# EAGLE design CPU Board (EAGLE 8.4.3)
CNAME: SO-DIMM CPU Module; CREVISION: V1; DESIGNER: Henrik K. B. Jensen
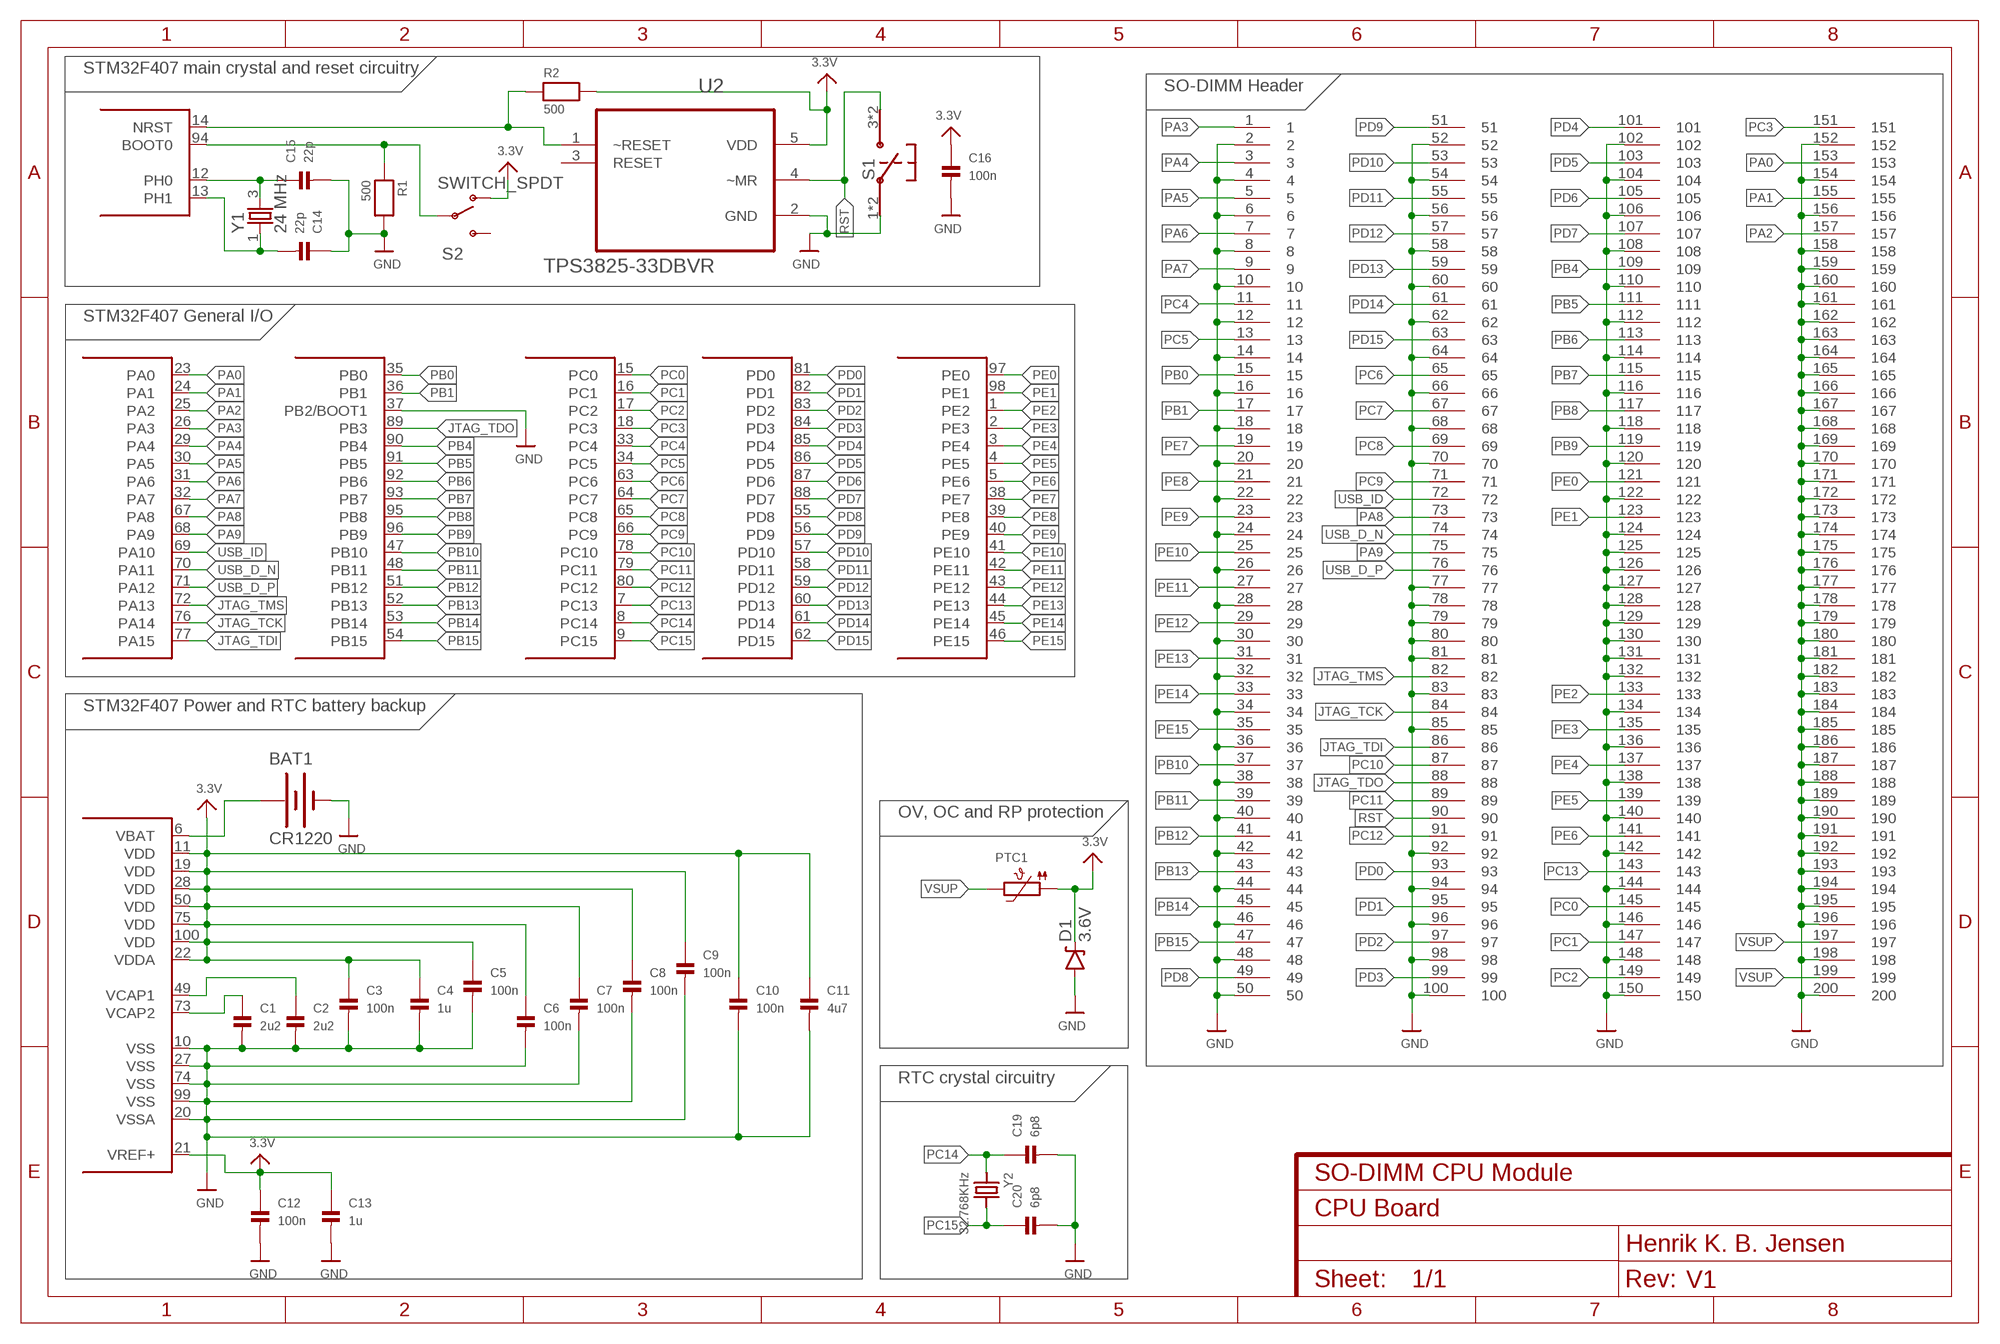
[diagram p0: schematic, sheet 1]

## Parts
BAT1  CR1220  BATTERY12PTH  [BATTCON_12MM_PTH]
C1  2u2  CAP_CERAMIC_0603  [_0603]
C2  2u2  CAP_CERAMIC_0603  [_0603]
C3  100n  CAP_CERAMIC_0603  [_0603]
C4  1u  CAP_CERAMIC_0603  [_0603]
C5  100n  CAP_CERAMIC_0603  [_0603]
C6  100n  CAP_CERAMIC_0603  [_0603]
C7  100n  CAP_CERAMIC_0603  [_0603]
C8  100n  CAP_CERAMIC_0603  [_0603]
C9  100n  CAP_CERAMIC_0603  [_0603]
C10  100n  CAP_CERAMIC_0603  [_0603]
C11  4u7  CAP_CERAMIC_0603  [_0603]
C12  100n  CAP_CERAMIC_0603  [_0603]
C13  1u  CAP_CERAMIC_0603  [_0603]
C14  22p  CAP_CERAMIC_0603  [_0603]
C15  22p  CAP_CERAMIC_0603  [_0603]
C16  100n  CAP_CERAMIC_0603  [_0603]
C19  6p8  CAP_CERAMIC_0603  [_0603]
C20  6p8  CAP_CERAMIC_0603  [_0603]
D1  3.6V  DIODE-ZENER3.3V  [SOD-323]
PTC1  PTC1206  [1206]
R1  500  RESISTOR_0603  [_0603]
R2  500  RESISTOR_0603  [_0603]
S1  PTS645SM43SMTR92  [PTS645]
S2  SWITCH_SPDT  [KPS-1290]
U1  STM32F4-100  [SQFP-S-14X14-100]
U2  TPS3825-33DBVR  [SOT95P280X145-5N]
U$19  SODIMM-2.5V-PCB  [SODIMM-2.5V-PCB]
Y1  24 MHz  CRYSTAL4PIN  [CRYSTAL-4PIN]
Y2  32.768KHz  CRYSTAL32.768  [CRYSTAL_CYL_2X6MM_SMT]

## Nets
3.3V: C3.1 C4.1 C5.1 C6.1 C7.1 C8.1 C9.1 C10.1 C11.1 C12.1 C13.1 C16.1 D1.C PTC1.1 R2.2 S2.O U1.11(VDD) U1.19(VDD) U1.21(VREF+) U1.22(VDDA) U1.28(VDD) U1.50(VDD) U1.75(VDD) U1.100(VDD) U2.5(VDD)
GND: BAT1.GND(-) C1.2 C2.2 C3.2 C4.2 C5.2 C6.2 C7.2 C8.2 C9.2 C10.2 C11.2 C12.2 C13.2 C14.1 C15.2 C16.2 C19.2 C20.2 D1.A R1.2 S1.1 S1.2 U1.10(VSS) U1.20(VSSA) U1.27(VSS) U1.37(PB2/BOOT1) U1.74(VSS) U1.99(VSS) U2.2(GND) U$19.2 U$19.4 U$19.6 U$19.8 U$19.10 U$19.12 U$19.14 U$19.16 U$19.18 U$19.20 U$19.22 U$19.24 U$19.26 U$19.28 U$19.30 U$19.32 U$19.34 U$19.36 U$19.38 U$19.40 U$19.42 U$19.44 U$19.46 U$19.48 U$19.50 U$19.52 U$19.54 U$19.56 U$19.58 U$19.60 U$19.62 U$19.64 U$19.66 U$19.68 U$19.70 U$19.77 U$19.78 U$19.79 U$19.80 U$19.81 U$19.83 U$19.85 U$19.92 U$19.94 U$19.96 U$19.98 U$19.100 U$19.102 U$19.104 U$19.106 U$19.108 U$19.110 U$19.112 U$19.114 U$19.116 U$19.118 U$19.120 U$19.122 U$19.124 U$19.125 U$19.126 U$19.127 U$19.128 U$19.129 U$19.130 U$19.131 U$19.132 U$19.134 U$19.136 U$19.138 U$19.140 U$19.142 U$19.144 U$19.146 U$19.148 U$19.150 U$19.152 U$19.154 U$19.156 U$19.158 U$19.159 U$19.160 U$19.161 U$19.162 U$19.163 U$19.164 U$19.165 U$19.166 U$19.167 U$19.168 U$19.169 U$19.170 U$19.171 U$19.172 U$19.173 U$19.174 U$19.175 U$19.176 U$19.177 U$19.178 U$19.179 U$19.180 U$19.181 U$19.182 U$19.183 U$19.184 U$19.185 U$19.186 U$19.187 U$19.188 U$19.189 U$19.190 U$19.191 U$19.192 U$19.193 U$19.194 U$19.195 U$19.196 U$19.198 U$19.200
JTAG_TCK: U1.76(PA14) U$19.84
JTAG_TDI: U1.77(PA15) U$19.86
JTAG_TDO: U1.89(PB3) U$19.88
JTAG_TMS: U1.72(PA13) U$19.82
N$1: C15.1 U1.12(PH0) Y1.3
N$2: C1.1 U1.73(VCAP2)
N$3: C2.1 U1.49(VCAP1)
N$4: R1.1 S2.P U1.94(BOOT0)
N$6: BAT1.VCC@1(+) U1.6(VBAT)
N$11: C14.2 U1.13(PH1) Y1.1
PA0: U1.23(PA0) U$19.153
PA1: U1.24(PA1) U$19.155
PA2: U1.25(PA2) U$19.157
PA3: U1.26(PA3) U$19.1
PA4: U1.29(PA4) U$19.3
PA5: U1.30(PA5) U$19.5
PA6: U1.31(PA6) U$19.7
PA7: U1.32(PA7) U$19.9
PA8: U1.67(PA8) U$19.73
PA9: U1.68(PA9) U$19.75
PB0: U1.35(PB0) U$19.15
PB1: U1.36(PB1) U$19.17
PB4: U1.90(PB4) U$19.109
PB5: U1.91(PB5) U$19.111
PB6: U1.92(PB6) U$19.113
PB7: U1.93(PB7) U$19.115
PB8: U1.95(PB8) U$19.117
PB9: U1.96(PB9) U$19.119
PB10: U1.47(PB10) U$19.37
PB11: U1.48(PB11) U$19.39
PB12: U1.51(PB12) U$19.41
PB13: U1.52(PB13) U$19.43
PB14: U1.53(PB14) U$19.45
PB15: U1.54(PB15) U$19.47
PC0: U1.15(PC0) U$19.145
PC1: U1.16(PC1) U$19.147
PC2: U1.17(PC2) U$19.149
PC3: U1.18(PC3) U$19.151
PC4: U1.33(PC4) U$19.11
PC5: U1.34(PC5) U$19.13
PC6: U1.63(PC6) U$19.65
PC7: U1.64(PC7) U$19.67
PC8: U1.65(PC8) U$19.69
PC9: U1.66(PC9) U$19.71
PC10: U1.78(PC10) U$19.87
PC11: U1.79(PC11) U$19.89
PC12: U1.80(PC12) U$19.91
PC13: U1.7(PC13) U$19.143
PC14: C19.1 U1.8(PC14) Y2.1
PC15: C20.1 U1.9(PC15) Y2.2
PD0: U1.81(PD0) U$19.93
PD1: U1.82(PD1) U$19.95
PD2: U1.83(PD2) U$19.97
PD3: U1.84(PD3) U$19.99
PD4: U1.85(PD4) U$19.101
PD5: U1.86(PD5) U$19.103
PD6: U1.87(PD6) U$19.105
PD7: U1.88(PD7) U$19.107
PD8: U1.55(PD8) U$19.49
PD9: U1.56(PD9) U$19.51
PD10: U1.57(PD10) U$19.53
PD11: U1.58(PD11) U$19.55
PD12: U1.59(PD12) U$19.57
PD13: U1.60(PD13) U$19.59
PD14: U1.61(PD14) U$19.61
PD15: U1.62(PD15) U$19.63
PE0: U1.97(PE0) U$19.121
PE1: U1.98(PE1) U$19.123
PE2: U1.1(PE2) U$19.133
PE3: U1.2(PE3) U$19.135
PE4: U1.3(PE4) U$19.137
PE5: U1.4(PE5) U$19.139
PE6: U1.5(PE6) U$19.141
PE7: U1.38(PE7) U$19.19
PE8: U1.39(PE8) U$19.21
PE9: U1.40(PE9) U$19.23
PE10: U1.41(PE10) U$19.25
PE11: U1.42(PE11) U$19.27
PE12: U1.43(PE12) U$19.29
PE13: U1.44(PE13) U$19.31
PE14: U1.45(PE14) U$19.33
PE15: U1.46(PE15) U$19.35
RESET: R2.1 U1.14(NRST) U2.1(~RESET)
RST: S1.3 S1.4 U2.4(~MR) U$19.90
USB_D_N: U1.70(PA11) U$19.74
USB_D_P: U1.71(PA12) U$19.76
USB_ID: U1.69(PA10) U$19.72
VSUP: PTC1.2 U$19.197 U$19.199
Unconnected: S2.S U2.3(RESET)

## Notes on the sheet
- STM32F407 main crystal and reset circuitry
- SO-DIMM Header
- STM32F407 General I/O
- STM32F407 Power and RTC battery backup
- OV, OC and RP protection
- RTC crystal circuitry

## Library data of the parts
BAT1 = SparkFun-Electromechanical:BATTERY: Battery Holders Various common sizes : AA, AAA, 18650 (PRT-12895), 20mm coin cell and 12mm coin cell. 20MM_4LEGS, BATT-10373; PROD_ID: BATT-08315
C1-C16 C19 C20 = microbuilder:CAP_CERAMIC: Ceramic Capacitors 0402 - 0402 Surface Mount Capacitors 16pF 50V 5% [Digikey: 445-4899-2-ND] 18pF 50V 5% [Digikey: 490-1281-2-ND] 22pF 50V 5% [Digikey: 490-1283-2-ND] 68pF 50V 5% [Digikey: 490-1289-2-ND] 0.1uF 10V 10% [Digikey: 490-1318-2-ND] 1.0uF 6.3V 10% [Digikey: 490-1320-2-ND] 0603 - 0603 Surface Mount Capacitors 16 pF 50V 5% [Digikey: 445-5051-2-ND] 22 pF 50V [Digikey: PCC220ACVTR-ND] 33 pF 50V 5% [Digikey: 490-1415-1-ND] 56pF 50V 5% [Digikey: 490-1421-1-ND] 220pF 50V 5% [Digikey: 445-1285-1-ND] 680 pF 50V 2200 pF 50V 5% C0G [Digikey: 445-1297-1-ND] 5600 pF 100V 5% X7R [Digikey: 478-3711-1-ND] 0.1 µF 25V 10% [Digikey: PCC2277TR-ND] 0.22 µF 16V 10% X7R [Digikey: 445-1318-1-ND] 1.0 µF 25V 10% [Digikey: 445-5146-2-ND] 0603 - RF Specific 3pF 250V +/-0.1pF RF [Digikey: 712-1347-1-ND] 18 pF 250V 5% [Digikey: 478-3505-1-ND or 712-1322-1-ND] 56 pF 250V 5% C0G RF [Digikey: 490-4867-1-ND] 68 pF 250V RF [Digikey: 490-4868-1-ND] 0805 - 0805 Surface Mount Capacitors 220 pF 250V 2% RF Ceramic Capacitor [Digikey: 712-1398-1-ND] 1000 pF 50V 2% NP0 Ceramic Capacitor [Digikey: 478-3760-1-ND] 0.1 µF 25V 10% Ceramic Capacitor [Digikey: PCC1828TR-ND] 1.0 µF 16V 10% Ceramic Capacitor[Digikey: 490-1691-2-ND] 10.0 µF 10V 10% Ceramic Capacitor[Digikey: 709-1228-1-ND] 10.0 uF 16V 10% Ceramic Capacitor [Digikey: 478-5165-2-ND] 47 uF 6.3V 20% Ceramic Capacitor [Digikey: 587-1779-1-ND or 399-5506-1-ND] 1206 - 1206 Surface Mount Capacitors 47uF 10V 20% Ceramic Capacitor [Digikey: 490-5528-1-ND or 399-5508-1-ND or 445-6010-1-ND] 100uF 6.3V -20%, +80% Y5V Ceramic Capacitor (Digikey: 490-4512-1-ND, Mouser: 81-GRM31CF50J107ZE1L)
D1 = SparkFun-DiscreteSemi:DIODE-ZENER: Zener Diode Production Part - 8199 3.4V Zener Voltage; PROD_ID: DIO-11284; VALUE: 3.3V
PTC1 = microbuilder:PTC: PTC (Resettable Fuse) 1206 Package 250mA PTC (16V Max, Time-to-Trip: 0.08s) - Digikey: F2110CT-ND 1210 Package 100mA PTC (30V Max, Time-to-Trip: 0.6s) - Digikey: MF-USMF010-2CT-ND 1812 Package 750mA PTC (24V Max, Time-to-Trip: 0.2s) - Digikey: MF-MSMF075/24-2CT-ND
R1 R2 = microbuilder:RESISTOR: Resistors 0402 - 0402 Surface Mount Package 22 Ohm 1% 1/16W [Digikey: 311-22.0LRTR-ND] 33 Ohm 5% 1/16W 1.0K 5% 1/16W 1.5K 5% 1/16W 2.0K 1% 1/16W 10.0K 1% 1/16W [Digikey: 311-10.0KLRTR-ND] 10.0K 5% 1/16W [Digikey: RMCF0402JT10K0TR-ND] 12.1K 1% 1/16W [Digikey: 311-22.0LRTR-ND] 100.0K 5% 1/16W 0603 - 0603 Surface Mount Package 0 Ohm 1/10 Watt 1% Resistor 15 Ohm 1/10 Watt 1% Resistor 33 Ohm 1/10 Watt 1% Resistor 49.9 Ohm 1/10 Watt 1% Resistor 100 Ohm 1/10 Watt 1% Resistor 150 Ohm 1/10 Watt 1% Resistor 240 Ohm 1/10 Watt 1% Resistor 390 Ohm 1/10 Watt 1% Resistor 560 Ohm 1/10 Watt 1% Resistor 680 Ohm 1/10 Watt 1% Resistor 750 Ohm 1/10 Watt 1% Resistor 1.0K Ohm 1/10 Watt 1% Resistor 1.5K Ohm 1/10 Watt 1% Resistor 2.0K Ohm 1/10 Watt 1% Resistor 2.2K Ohm 1/10 Watt 1% Resistor 3.3K Ohm 1/10 Watt 1% Resistor 4.7K Ohm 1/10 Watt 1% Resistor 10.0K Ohm 1/10 Watt 1% Resistor 12.0K Ohm 1/10 Watt 1% Resistor 12.1K Ohm 1/10 Watt 1% Resistor 20.0K Ohm 1/10 Watt 1% Resistor 33.0K Ohm 1/10 Watt 1% Resistor 100.0K Ohm 1/10 Watt 1% Resistor 0805 - 0805 Surface Mount Package 0 Ohm 1/8 Watt 1% Resistor 33 Ohm 1/8 Watt 1% Resistor 100 Ohm 1/8 Watt 1% Resistor 150 Ohm 1/8 Watt 1% Resistor 200 Ohm 1/8 Watt 1% Resistor 240 Ohm 1/8 Watt 1% Resistor 330 Ohm 1/8 Watt 1% Resistor 390 Ohm 1/8 Watt 1% Resistor 470 Ohm 1/8 Watt 1% Resistor 1.0K Ohm 1/8 Watt 1% Resistor 1.5K Ohm 1/8 Watt 1% Resistor 2.0K Ohm 1/8 Watt 1% Resistor 4.7K Ohm 1/8 Watt 1% Resistor 5.1K Ohm 1/8 Watt 1% Resistor 5.6K Ohm 1/8 Watt 1% Resistor 10.0K Ohm 1/8 Watt 1% Resistor 22.0K Ohm 1/8 Watt 1% Resistor 33.0K Ohm 1/8 Watt 1% Resistor 100K Ohm 1/8 Watt 1% Resistor 1206 - 1206 Surface Mount Package 2012 - 2010 Surface Mount Package 0.11 Ohm 1/2 Watt 1% Resistor - Digikey: RHM.11UCT-ND
S1 = switches:PTS645SM43SMTR92: Tactile Switch SPST-NO Top Actuated Surface Mount; DIGIKEY: CKN9112CT-ND
S2 = SparkFun-Electromechanical:SWITCH_SPDT: SWCH-10651 Side-actuated SPDT slide switch, as used on the Arduino Pro; PROD_ID: SWCH-10651
U1 = apbteam_stm32:STM32F4-100: STM32F4, 100 pin package According to STM32F40x datasheet, almost compatible with STM32F4xx, STM32F2xx, some pins must be connected differently, see chapter 2.1.
U2 = Texas Instruments_By_element14_Batch_1:TPS3825-33DBVR: PROCESSOR SUPERVISORY CIRCUITS; MPN: TPS3825-33DBVR; OC_FARNELL: 1535758; OC_NEWARK: 77C0425; PACKAGE: SOT-23-5; SUPPLIER: Texas Instruments
U$19 = AAU-Racing:SODIMM-2.5V-PCB
Y1 = BaseApp:CRYSTAL: CRYSTAL SMD-10.5X4.8-2PIN :- http://www.digikey.com/product-detail/en/CX49GFNB12000H0PESZZ/478-4349-1-ND/1532102 SMD-5X3- 4PIN :- 535-11281-1-ND
Y2 = microbuilder:CRYSTAL: Crystals HC49UP - Surface Mount Crystal 4.0MHz 18pF +/-30ppm Surface Mount Crystal [Digikey: 535-9857-1-ND] 12.0 MHz Surface Mount Crystal [Digikey: 535-9869-6-ND] 25.0 MHz Surface Mount Crystal [Digikey: 535-9078-1-ND] 2.5 x 2.0mm - MEMs SMT Crystal 16.0 MHz 10pF 20ppm 2.5 x 2.0mm Crystal [Digikey -40-85°C: 535-10923-1-ND] 3.2 x 2.5mm - MEMs SMT Crystal 12.0 MHz 8pF 15ppm 3.2 x 2.5mm Crystal [Digikey: -10-70°C: 644-1047-1-ND -40-125°C: 644-1128-1-ND] 16.0 MHz 8pF 15ppm 3.2 x 2.5mm Crystal [Digikey: -10-70°C: 644-1049-1-ND -40-125°C: 644-1129-2-ND] 16.0 MHz 10pF 10ppm 3.2 x 2.5mm Crystal [Digikey: 644-1100-1-ND] 27.12 MHz 18pF 30ppm 3.2 x 2.5mm Crystal [Digikey: 887-1424-1-ND] 27.12MHz 10pF 10ppm 3.2 x 2.5mm Crystal [Digikey: 887-1329-1-ND] 4.9 x 1.8mm - MEMs SMT Crystal 32.768 KHz 12.5pF 20ppm 4.9 x 1.8mm Crystal [Digikey: SE2415CT-ND] 8.0 x 3.8mm - Surface Mount Crystal 32.768kHz 12.5pF 20ppm -40°C-85°C [Digikey: 535-9166-2-ND] Cylinder 32.768KHz Cylinder Crystal (2x6mm body) [Ex. Digikey: 300-8341-2-ND]

## Board
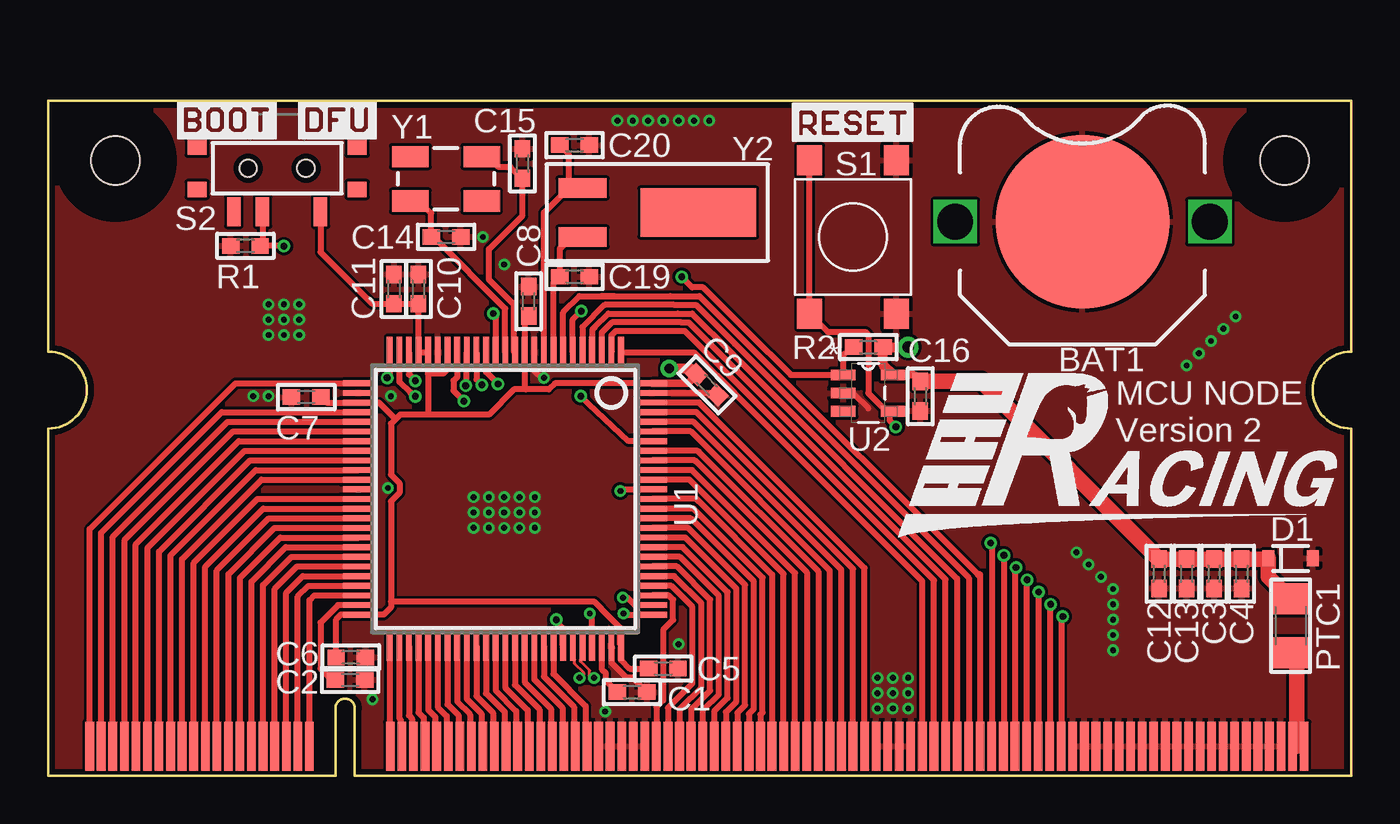
[diagram p1: board, top side]
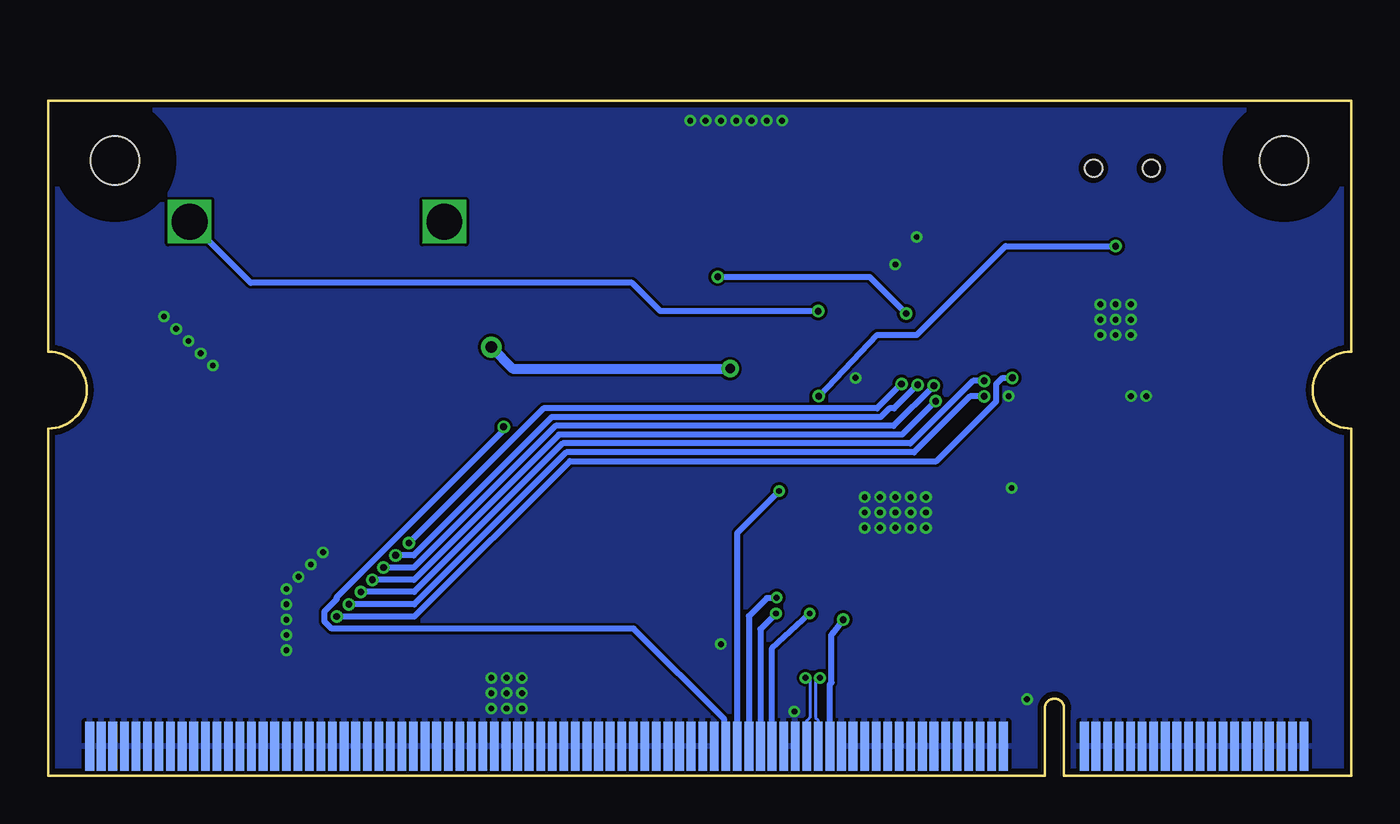
[diagram p2: board, bottom side, seen from below]

Size 67.6 x 35 mm. Coordinates in mm from the lower left corner, seen from the top.
Copper layers (1*16): Top 0.035mm / dielectric 1.5mm / Bottom 0.035mm
Design rules "PCB-POOL Standard": minimum track width 0.15mm, minimum drill 0.3mm, track to track 0.15mm, track to pad 0.15mm, pad to pad 0.15mm, via to via 0.15mm, smd to smd 0.15mm, copper to edge 0.3mm, drill to drill 0.2mm, minimum pad ring 0.2mm, minimum via ring 0.15mm, stop-mask expansion 0.075mm, vias tented up to drill 0mil, thermal gap 0.2mm
Holes 2.5 mm at 3.49,31.91 64.14,31.91
tKeepout: area 0.5,28.9 to 6.5,34.9; area 61.1,28.9 to 67.2,34.9
bKeepout: area 0.5,28.9 to 6.5,34.9; area 61.1,28.9 to 67.2,34.9
tRestrict: area 0.5,28.9 to 6.5,34.9; area 61.1,28.9 to 67.2,34.9
bRestrict: area 0.5,28.9 to 6.5,34.9; area 61.1,28.9 to 67.2,34.9

### Footprints (pad centres in the part's own frame; a part is rotated, then mirrored left to right if it is on the bottom)
BATTCON_12MM_PTH = smd 9 x 9: GND 0,0 | drill 1.854 square: VCC@1 6.604,0; VCC@2 -6.604,0
_0603 = smd 0.9 x 0.8: 1 -0.762,0; 2 0.762,0
SOD-323 = smd 0.63 x 0.83: A 1.15,0; C -1.15,0
1206 = smd 1.6 x 1.8: 1 -1.4,0; 2 1.4,0
PTS645 = smd 1.55 x 1.3: 1 -3.975,2.25; 2 3.975,2.25; 3 3.975,-2.25; 4 -3.975,-2.25
KPS-1290 = smd 0.7 x 1.5: O -2.25,2.25; P 0.75,2.25; S 2.25,2.25 | smd 1 x 0.8: P$1 -4.15,1.1; P$2 -4.15,-1.1; P$3 4.15,-1.1; P$4 4.15,1.1 | hole 0.9: -1.5,0; 1.5,0
SQFP-S-14X14-100 = smd 0.3 x 1.6: 1 -6,-7.6; 2 -5.5,-7.6; 3 -5,-7.6; 4 -4.5,-7.6; 5 -4,-7.6; 6 -3.5,-7.6; 7 -3,-7.6; 8 -2.5,-7.6; 9 -2,-7.6; 10 -1.5,-7.6; 11 -1,-7.6; 12 -0.5,-7.6; 13 0,-7.6; 14 0.5,-7.6; 15 1,-7.6; 16 1.5,-7.6; 17 2,-7.6; 18 2.5,-7.6; 19 3,-7.6; 20 3.5,-7.6; 21 4,-7.6; 22 4.5,-7.6; 23 5,-7.6; 24 5.5,-7.6; 25 6,-7.6; 51 6,7.6; 52 5.5,7.6; 53 5,7.6; 54 4.5,7.6; 55 4,7.6; 56 3.5,7.6; 57 3,7.6; 58 2.5,7.6; 59 2,7.6; 60 1.5,7.6; 61 1,7.6; 62 0.5,7.6; 63 0,7.6; 64 -0.5,7.6; 65 -1,7.6; 66 -1.5,7.6; 67 -2,7.6; 68 -2.5,7.6; 69 -3,7.6; 70 -3.5,7.6; 71 -4,7.6; 72 -4.5,7.6; 73 -5,7.6; 74 -5.5,7.6; 75 -6,7.6 | smd 1.6 x 0.3: 26 7.6,-6; 27 7.6,-5.5; 28 7.6,-5; 29 7.6,-4.5; 30 7.6,-4; 31 7.6,-3.5; 32 7.6,-3; 33 7.6,-2.5; 34 7.6,-2; 35 7.6,-1.5; 36 7.6,-1; 37 7.6,-0.5; 38 7.6,0; 39 7.6,0.5; 40 7.6,1; 41 7.6,1.5; 42 7.6,2; 43 7.6,2.5; 44 7.6,3; 45 7.6,3.5; 46 7.6,4; 47 7.6,4.5; 48 7.6,5; 49 7.6,5.5; 50 7.6,6; 76 -7.6,6; 77 -7.6,5.5; 78 -7.6,5; 79 -7.6,4.5; 80 -7.6,4; 81 -7.6,3.5; 82 -7.6,3; 83 -7.6,2.5; 84 -7.6,2; 85 -7.6,1.5; 86 -7.6,1; 87 -7.6,0.5; 88 -7.6,0; 89 -7.6,-0.5; 90 -7.6,-1; 91 -7.6,-1.5; 92 -7.6,-2; 93 -7.6,-2.5; 94 -7.6,-3; 95 -7.6,-3.5; 96 -7.6,-4; 97 -7.6,-4.5; 98 -7.6,-5; 99 -7.6,-5.5; 100 -7.6,-6
SOT95P280X145-5N = smd 1.27 x 0.559: 1 -1.295,0.94; 2 -1.295,0; 3 -1.295,-0.94; 4 1.295,-0.94; 5 1.295,0.94
SODIMM-2.5V-PCB = smd 0.45 x 2.55: 1 2.15,1.525; 3 2.75,1.525; 5 3.35,1.525; 7 3.95,1.525; 9 4.55,1.525; 11 5.15,1.525; 13 5.75,1.525; 15 6.35,1.525; 17 6.95,1.525; 19 7.55,1.525; 21 8.15,1.525; 23 8.75,1.525; 25 9.35,1.525; 27 9.95,1.525; 29 10.55,1.525; 31 11.15,1.525; 33 11.75,1.525; 35 12.35,1.525; 37 12.95,1.525; 39 13.55,1.525; 41 17.75,1.525; 43 18.35,1.525; 45 18.95,1.525; 47 19.55,1.525; 49 20.15,1.525; 51 20.75,1.525; 53 21.35,1.525; 55 21.95,1.525; 57 22.55,1.525; 59 23.15,1.525; 61 23.75,1.525; 63 24.35,1.525; 65 24.95,1.525; 67 25.55,1.525; 69 26.15,1.525; 71 26.75,1.525; 73 27.35,1.525; 75 27.95,1.525; 77 28.55,1.525; 79 29.15,1.525; 81 29.75,1.525; 83 30.35,1.525; 85 30.95,1.525; 87 31.55,1.525; 89 32.15,1.525; 91 32.75,1.525; 93 33.35,1.525; 95 33.95,1.525; 97 34.55,1.525; 99 35.15,1.525; 101 35.75,1.525; 103 36.35,1.525; 105 36.95,1.525; 107 37.55,1.525; 109 38.15,1.525; 111 38.75,1.525; 113 39.35,1.525; 115 39.95,1.525; 117 40.55,1.525; 119 41.15,1.525; 121 41.75,1.525; 123 42.35,1.525; 125 42.95,1.525; 127 43.55,1.525; 129 44.15,1.525; 131 44.75,1.525; 133 45.35,1.525; 135 45.95,1.525; 137 46.55,1.525; 139 47.15,1.525; 141 47.75,1.525; 143 48.35,1.525; 145 48.95,1.525; 147 49.55,1.525; 149 50.15,1.525; 151 50.75,1.525; 153 51.35,1.525; 155 51.95,1.525; 157 52.55,1.525; 159 53.15,1.525; 161 53.75,1.525; 163 54.35,1.525; 165 54.95,1.525; 167 55.55,1.525; 169 56.15,1.525; 171 56.75,1.525; 173 57.35,1.525; 175 57.95,1.525; 177 58.55,1.525; 179 59.15,1.525; 181 59.75,1.525; 183 60.35,1.525; 185 60.95,1.525; 187 61.55,1.525; 189 62.15,1.525; 191 62.75,1.525; 193 63.35,1.525; 195 63.95,1.525; 197 64.55,1.525; 199 65.15,1.525 | smd 0.45 x 2.55 bottom: 2 2.45,1.525; 4 3.05,1.525; 6 3.65,1.525; 8 4.25,1.525; 10 4.85,1.525; 12 5.45,1.525; 14 6.05,1.525; 16 6.65,1.525; 18 7.25,1.525; 20 7.85,1.525; 22 8.45,1.525; 24 9.05,1.525; 26 9.65,1.525; 28 10.25,1.525; 30 10.85,1.525; 32 11.45,1.525; 34 12.05,1.525; 36 12.65,1.525; 38 13.25,1.525; 40 13.85,1.525; 42 18.05,1.525; 44 18.65,1.525; 46 19.25,1.525; 48 19.85,1.525; 50 20.45,1.525; 52 21.05,1.525; 54 21.65,1.525; 56 22.25,1.525; 58 22.85,1.525; 60 23.45,1.525; 62 24.05,1.525; 64 24.65,1.525; 66 25.25,1.525; 68 25.85,1.525; 70 26.45,1.525; 72 27.05,1.525; 74 27.65,1.525; 76 28.25,1.525; 78 28.85,1.525; 80 29.45,1.525; 82 30.05,1.525; 84 30.65,1.525; 86 31.25,1.525; 88 31.85,1.525; 90 32.45,1.525; 92 33.05,1.525; 94 33.65,1.525; 96 34.25,1.525; 98 34.85,1.525; 100 35.45,1.525; 102 36.05,1.525; 104 36.65,1.525; 106 37.25,1.525; 108 37.85,1.525; 110 38.45,1.525; 112 39.05,1.525; 114 39.65,1.525; 116 40.25,1.525; 118 40.85,1.525; 120 41.45,1.525; 122 42.05,1.525; 124 42.65,1.525; 126 43.25,1.525; 128 43.85,1.525; 130 44.45,1.525; 132 45.05,1.525; 134 45.65,1.525; 136 46.25,1.525; 138 46.85,1.525; 140 47.45,1.525; 142 48.05,1.525; 144 48.65,1.525; 146 49.25,1.525; 148 49.85,1.525; 150 50.45,1.525; 152 51.05,1.525; 154 51.65,1.525; 156 52.25,1.525; 158 52.85,1.525; 160 53.45,1.525; 162 54.05,1.525; 164 54.65,1.525; 166 55.25,1.525; 168 55.85,1.525; 170 56.45,1.525; 172 57.05,1.525; 174 57.65,1.525; 176 58.25,1.525; 178 58.85,1.525; 180 59.45,1.525; 182 60.05,1.525; 184 60.65,1.525; 186 61.25,1.525; 188 61.85,1.525; 190 62.45,1.525; 192 63.05,1.525; 194 63.65,1.525; 196 64.25,1.525; 198 64.85,1.525; 200 65.45,1.525
CRYSTAL-4PIN = smd 1.9 x 1.1: 1 -1.85,-1.15; 2 1.85,-1.15; 3 1.85,1.15; 4 -1.85,1.15
CRYSTAL_CYL_2X6MM_SMT = smd 2.5 x 1: 1 2.125,1.27; 2 2.125,-1.27 | smd 6 x 2.5: CYLINDER -3.875,0

### Placement (x,y rotation side)
BAT1  53.66,28.73 0 top
C1  30.29,4.34 0 top
C2  15.66,4.97 0 top
C3  60.48,10.48 270 top
C4  61.91,10.48 270 top
C5  31.91,5.56 0 top
C6  15.7,6.14 0 top
C7  13.39,19.64 180 top
C8  24.92,24.61 90 top
C9  34.18,20.27 315 top
C10  19.21,25.24 90 top
C11  17.94,25.24 90 top
C12  57.63,10.48 270 top
C13  59.05,10.48 270 top
C14  20.64,27.94 180 top
C15  24.61,31.75 90 top
C16  45.24,19.68 270 top
C19  27.3,25.88 0 top
C20  27.3,32.7 0 top
D1  64.45,11.27 0 top
PTC1  64.45,7.78 270 top
R1  10.24,27.48 180 top
R2  42.55,22.23 0 top
S1  41.75,27.94 270 top
S2  11.87,31.5 180 top
U1  23.71,14.35 180 top
U2  42.55,19.84 0 top
U$19  0,0 0 top
Y1  20.64,30.96 0 top
Y2  29.84,29.21 180 top

### Tracks (layer width: path | path; a pad name or v marks a point on that pad's centre or on a via)
3.3V  (via drill 0.5, 0.6)
  Top 0.305: C6.1 14.94,8.11 15.18,8.35 U1.50 17.4,8.35 17.78,8.73 17.78,9.05 | C7.1 14.43,19.35 U1.28 17.16,19.35 18.02,18.49 | C5.1 30.16,5.56 29.71,6.01 U1.75 29.67,6.8 29.67,7.68 28.7,8.64 28.7,8.66 28.35,9.02 17.81,9.02 17.78,9.05 | C8.1 24.71,23.63 U1.11 24.71,20.09 24.77,20.04 | S2.O 14.12,27.15 16.8,24.48 C11.1 C10.1 U1.22 U1.21 19.71,20.8 | 18.02,18.49 17.78,18.26 17.78,15.62 18.22,15.17 18.22,14.67 17.78,14.23 17.78,9.05 | 19.68,18.73 22.86,18.73 24.16,20.04 24.77,20.04 | 19.68,18.73 18.26,18.73 18.02,18.49 | 19.71,20.8 19.71,18.76 19.68,18.73 | 19.71,20.8 19.77,20.85 20.49,20.85 20.71,21.08 U1.19 | 24.77,20.04 25.97,20.04 26.29,20.35 U1.100
  Top 0.381: C9.1 33.18,20.35 U1.100
  Top 0.406: U2.5 44.91,20.78 C16.1
  Top 0.508: U2.5 43.31,21.32 R2.2 v44.61,22.23 | v32.23,21.11 33.34,21.11 C9.1
  Top 0.813: PTC1.1 63.3,10.33 D1.C 63.27,11.24 C4.1 C3.1 C13.1 C12.1 48.42,20.45 C16.1
  Bottom 0.508: v44.61,22.23 43.5,21.11 v32.23,21.11
GND  (via drill 0.3)
  Top 0.305: C1.2 30.29,5.1 29.97,5.1 29.21,5.86 U1.74 | U1.99 34.6,19.85 C9.2 | U2.2 41.74,19.84 42.54,19.05 | U1.10 25.21,20.98 25.56,20.64 v25.72,20.64
  other vias: 11.43,19.68 10.64,19.68 23.65,26.51 32.7,6.83 28.89,3.33 22.54,27.94 17.78,19.68 43.02,3.49 43.81,3.49 44.61,3.49 43.02,4.29 43.81,4.29 44.61,4.29 44.61,5.08 43.81,5.08 43.02,5.08 16.83,3.97 17.62,14.92 23.65,14.45 13.02,23.65 12.22,23.65 11.43,23.65 11.43,24.45 12.22,24.45 13.02,24.45 13.02,22.86 12.22,22.86 11.43,22.86 29.53,33.97 30.32,33.97 31.11,33.97 31.91,33.97 32.7,33.97 33.5,33.97 34.29,33.97 59.05,21.27 59.69,21.91 60.33,22.54 60.96,23.18 61.59,23.81 53.34,11.59 53.98,10.95 54.61,10.32 55.24,9.68 55.24,8.89 55.24,8.1 55.24,7.3 55.24,6.51 22.86,14.45 22.07,14.45 23.65,13.65 23.65,12.86 24.45,14.45 25.24,14.45 22.07,12.86 22.07,13.65 22.86,13.65 22.86,12.86 24.45,12.86 24.45,13.65 25.24,13.65 25.24,12.86
  pour Top: 0,0 67.63,0 67.63,34.92 0,34.92
  pour Bottom: 0,0 67.63,0 67.63,34.92 0,34.92
JTAG_TCK  (via drill 0.3)
  Top 0.305: v29.84,8.41 29.94,8.35 U1.76
  Bottom 0.305: v29.84,8.41 30.65,7.61 U$19.84
JTAG_TDI  (via drill 0.3)
  Top 0.305: v29.82,9.24 30.05,9.24 30.43,8.85 U1.77
  Bottom 0.305: v29.82,9.24 29.84,9.21 30.32,9.21 31.25,8.28 U$19.86
JTAG_TDO  (via drill 0.3)
  Top 0.305: v29.69,14.76 29.78,14.85 U1.89
  Bottom 0.305: U$19.88 31.85,12.6 v29.69,14.76
JTAG_TMS  (via drill 0.3)
  Top 0.305: U1.72 28.21,8.41 v28.1,8.41
  Bottom 0.305: U$19.82 30.05,6.62 v28.1,8.41
N$1
  Top 0.305: U1.12 24.17,22 24.17,24.42 22.86,25.73 22.86,27.3 24.61,29.05 C15.1 24.57,30.99 23.97,31.59 23.34,31.59 22.82,32.11 Y1.3
N$2
  Top 0.305: U1.73 28.71,5.53 28.92,5.33 28.92,4.95 C1.1
N$3
  Top 0.305: C2.1 14.72,4.97 14.13,5.56 14.13,7.95 15.04,8.85 U1.49
N$4  (via drill 0.35)
  Top 0.305: S2.P 11.12,27.61 R1.1 12.21,27.48 v12.22,27.46 | U1.94 30.11,17.35 v27.62,19.68
  Bottom 0.305: v27.62,19.68 24.61,22.86 22.54,22.86 17.94,27.46 v12.22,27.46
N$6  (via drill 0.35)
  Top 0.305: U1.6 27.21,23.65 v27.66,24.09
  Bottom 0.305: v27.66,24.09 35.84,24.09 37.31,25.56 57.09,25.56 BAT1.VCC@1
N$11
  Top 0.305: U1.13 23.71,24.23 20,27.94 C14.2 19.88,29.18 19.37,29.69 18.91,29.69 Y1.1
PA0  (via drill 0.35)
  Top 0.305: U1.23 18.71,20.82 v19.05,20.48 | v51.38,9.53 51.38,1.55 U$19.153
  Bottom 0.305: v19.05,20.48 19.63,20.48 22.88,17.23 40.91,17.23 48.61,9.53 v51.37,9.53 v51.38,9.53
PA1  (via drill 0.35)
  Top 0.305: v19.05,19.68 18.88,19.85 18.79,19.85 18.21,20.43 U1.24 | 52.01,1.58 U$19.155 51.95,8.84 v52.01,8.89
  Bottom 0.305: v19.05,19.68 19.79,19.68 22.69,16.78 40.72,16.78 48.61,8.89 v52.01,8.89
PA2  (via drill 0.35)
  Top 0.305: U1.25 17.71,20.77 v17.59,20.64 | v52.63,8.26 52.55,8.17 U$19.157
  Bottom 0.305: v52.62,8.26 v52.63,8.26 v52.62,8.26 | v17.59,20.64 18.1,20.64 18.41,20.32 18.41,19.81 18.42,19.8 18.42,19.42 21.52,16.32 40.54,16.32 48.59,8.26 v52.62,8.26
PA3
  Top 0.305: U$19.1 2.15,12.79 9.72,20.35 U1.26
PA4
  Top 0.305: U$19.3 2.75,12.59 9.01,18.85 U1.29
PA5
  Top 0.305: U$19.5 3.35,12.4 9.3,18.35 U1.30
PA6
  Top 0.305: U$19.7 3.95,12.21 9.6,17.85 U1.31
PA7
  Top 0.305: U$19.9 4.55,12.01 9.89,17.35 U1.32
PA8
  Top 0.305: U1.67 25.71,5.14 27.28,3.57 27.28,1.6 U$19.73
PA9
  Top 0.305: U1.68 26.21,5.28 27.88,3.62 27.88,1.6 U$19.75
PB0
  Top 0.305: U$19.15 6.35,11.43 10.77,15.85 U1.35
PB1
  Top 0.305: U$19.17 6.95,11.24 11.07,15.35 U1.36
PB4
  Top 0.305: U$19.109 38.15,10.47 33.27,15.35 U1.90
PB5
  Top 0.305: U$19.111 38.75,10.51 33.41,15.85 U1.91
PB6
  Top 0.305: U$19.113 39.35,10.55 33.6,16.3 | 33.6,16.31 33.6,16.3 | 33.6,16.3 33.55,16.35 U1.92
PB7
  Top 0.305: U$19.115 39.95,10.6 33.77,16.78 | 33.74,16.81 33.77,16.78 | 33.77,16.78 33.7,16.85 U1.93
PB8
  Top 0.305: U$19.117 40.55,10.64 33.34,17.85 U1.95
PB9
  Top 0.305: U$19.119 41.15,10.69 33.48,18.35 U1.96
PB10
  Top 0.305: U$19.37 12.95,9.3 13.51,9.85 U1.47
PB11
  Top 0.305: U$19.39 13.55,9.11 13.8,9.35 U1.48
PB12
  Top 0.305: U1.51 17.71,1.56 U$19.41
PB13
  Top 0.305: U1.52 18.21,2.99 18.28,2.92 18.28,1.6 U$19.43
PB14
  Top 0.305: U1.53 18.71,3.13 18.88,2.97 18.88,1.6 U$19.45
PB15
  Top 0.305: U1.54 19.21,3.28 19.48,3.01 19.48,1.6 U$19.47
PC0  (via drill 0.35)
  Top 0.305: U1.15 22.71,20.94 v23.34,20.32 | v48.9,12.06 48.95,12.01 U$19.145
  Bottom 0.305: v23.34,20.32 24.61,19.05 41.91,19.05 v48.9,12.06
PC1  (via drill 0.35)
  Top 0.305: U1.16 22.21,20.56 v22.5,20.27 | v49.58,11.43 49.58,1.55 U$19.147
  Bottom 0.305: v22.5,20.27 23.72,19.05 23.96,19.05 24.42,18.59 41.48,18.59 48.64,11.43 v49.58,11.43
PC2  (via drill 0.35)
  Top 0.305: U1.17 21.71,20.28 v21.66,20.23 | v50.2,10.79 50.15,10.74 U$19.149
  Bottom 0.305: v50.2,10.79 48.63,10.79 41.29,18.14 23.74,18.14 v21.66,20.23
PC3  (via drill 0.35)
  Top 0.305: v21.57,19.43 21.03,19.97 21.03,20.49 21.21,20.67 U1.18 | v50.78,10.16 50.75,10.13 U$19.151
  Bottom 0.305: v50.78,10.16 48.63,10.16 41.1,17.69 23.31,17.69 v21.57,19.43
PC4
  Top 0.305: U$19.11 5.15,11.82 10.19,16.85 U1.33
PC5
  Top 0.305: U$19.13 5.75,11.62 10.48,16.35 U1.34
PC6
  Top 0.305: U1.63 23.71,4.57 24.88,3.4 24.88,1.6 U$19.65
PC7
  Top 0.305: U1.64 24.21,4.71 25.48,3.44 25.48,1.6 U$19.67
PC8
  Top 0.305: U1.65 24.71,4.85 26.08,3.49 26.08,1.6 U$19.69
PC9
  Top 0.305: U1.66 25.21,5 26.68,3.53 26.68,1.6 U$19.71
PC10
  Top 0.305: U$19.87 31.55,3.56 31.9,3.91 31.9,7.56 32.41,8.08 32.41,9.13 32.19,9.35 U1.78
PC11
  Top 0.305: U$19.89 32.15,3.52 33.42,4.79 33.42,8.76 32.33,9.85 U1.79
PC12
  Top 0.305: U$19.91 32.75,3.47 33.88,4.6 33.88,8.95 32.48,10.35 U1.80
PC13
  Top 0.305: 32.28,24.88 | 48.28,1.6 U$19.143 48.35,10.44 48.22,10.44 | 32.28,24.88 33.78,24.88 36.08,22.58 48.22,10.44 | 48.22,10.44 48.28,10.38 | 29.37,24.88 32.28,24.88 | 29.37,24.88 28.68,24.88 | 28.68,24.88 29.37,24.88 | 28.68,24.88 27.55,24.88 26.71,24.04 U1.7
PC14
  Top 0.305: U1.8 26.21,25.55 C19.1 26.54,27.34 27.15,27.94 Y2.1
PC15
  Top 0.305: U1.9 25.71,28.73 25.71,28.77 25.71,29.2 26.99,30.48 | 26.99,30.48 Y2.2 | C20.1 26.99,32.26 26.99,30.48
PD0
  Top 0.305: U$19.93 33.35,3.43 34.33,4.41 34.33,9.14 32.62,10.85 U1.81
PD1
  Top 0.305: U$19.95 33.95,3.38 34.79,4.22 34.79,9.33 32.76,11.35 U1.82
PD2
  Top 0.305: U$19.97 34.55,3.34 35.24,4.03 35.24,9.52 32.91,11.85 U1.83
PD3
  Top 0.305: U$19.99 35.15,3.3 35.7,3.85 35.7,9.71 33.05,12.35 U1.84
PD4
  Top 0.305: U$19.101 35.75,3.26 36.15,3.66 36.15,9.89 33.19,12.85 U1.85
PD5
  Top 0.305: U$19.103 36.35,3.21 36.61,3.47 36.61,10.08 33.34,13.35 U1.86
PD6
  Top 0.305: U$19.105 36.95,3.17 37.06,3.28 37.06,10.27 33.48,13.85 U1.87
PD7
  Top 0.305: U$19.107 37.55,10.43 33.75,14.22 | 33.67,14.31 33.75,14.22 | 33.75,14.22 33.62,14.35 U1.88
PD8
  Top 0.305: U1.55 19.71,3.42 20.08,3.06 20.08,1.6 U$19.49
PD9
  Top 0.305: U1.56 20.21,3.56 20.68,3.1 20.68,1.6 U$19.51
PD10
  Top 0.305: U1.57 20.71,3.71 21.28,3.14 21.28,1.6 U$19.53
PD11
  Top 0.305: U1.58 21.21,3.85 21.88,3.18 21.88,1.6 U$19.55
PD12
  Top 0.305: U1.59 21.71,3.99 22.48,3.23 22.48,1.6 U$19.57
PD13
  Top 0.305: U1.60 22.21,4.14 23.08,3.27 23.08,1.6 U$19.59
PD14
  Top 0.305: U1.61 22.71,4.28 23.68,3.31 23.68,1.6 U$19.61
PD15
  Top 0.305: U1.62 23.21,4.42 24.28,3.36 24.28,1.6 U$19.63
PE0
  Top 0.305: U$19.121 41.75,10.73 33.62,18.85 U1.97
PE1
  Top 0.305: U$19.123 42.35,10.77 33.77,19.35 U1.98
PE2
  Top 0.305: 35.42,20.02 34.81,20.64 33.49,21.95 U1.1 | 35.42,20.02 | 35.62,19.82 35.42,20.02 | 35.62,19.82 | 33.68,21.76 34.34,21.11 45.35,10.1 U$19.133 | 33.68,21.76 | 33.68,21.76 35.62,19.82
PE3
  Top 0.305: 45.88,1.6 U$19.135 45.95,10.14 34.8,21.29 33.03,23.06 29.44,23.06 29.21,22.83 U1.2
PE4
  Top 0.305: 32.84,23.51 | 32.84,23.51 33.22,23.51 34.98,21.75 46.55,10.18 U$19.137 46.48,1.6 | 32.84,23.51 29.25,23.51 28.71,22.98 U1.3
PE5
  Top 0.305: 28.26,23.16 28.34,23.25 | 28.34,23.25 29.06,23.97 32.66,23.97 | 32.66,23.97 | 32.66,23.97 33.41,23.97 35.44,21.94 47.15,10.22 U$19.139 | 28.34,23.25 28.21,23.12 U1.4
PE6
  Top 0.305: 32.47,24.42 28.87,24.42 27.71,23.26 U1.5 | 32.47,24.42 | 32.47,24.42 33.6,24.42 35.63,22.39 47.75,10.27 U$19.141
PE7
  Top 0.305: U$19.19 7.55,11.04 10.86,14.35 U1.38
PE8
  Top 0.305: U$19.21 8.15,10.85 11.15,13.85 U1.39
PE9
  Top 0.305: U$19.23 8.75,10.65 11.45,13.35 U1.40
PE10
  Top 0.305: U$19.25 9.35,10.46 11.74,12.85 U1.41
PE11
  Top 0.305: U$19.27 9.95,10.27 12.04,12.35 U1.42
PE12
  Top 0.305: U$19.29 10.55,10.07 12.33,11.85 U1.43
PE13
  Top 0.305: U$19.31 11.15,9.88 12.62,11.35 U1.44
PE14
  Top 0.305: U$19.33 11.75,9.69 12.92,10.85 U1.45
PE15
  Top 0.305: U$19.35 12.35,9.49 13.21,10.35 U1.46
RESET  (via drill 0.35)
  Top 0.305: v32.86,25.88 33.41,25.33 33.97,25.33 36.27,23.03 38.52,20.78 U2.1 41.25,21.85 R2.1 | v23.09,23.97 23.21,23.84 U1.14
  Bottom 0.305: v32.86,25.88 24.99,25.88 v23.09,23.97
RST  (via drill 0.35)
  Top 0.305: 43.66,18.9 43.48,18.9 42.55,19.84 42.55,22.86 42.39,23.02 40.45,23.02 S1.3 S1.4 | 43.66,18.9 U2.4 | v43.97,18.1 43.66,18.41 43.66,18.9
  Bottom 0.305: U$19.90 32.52,1.6 32.52,2.92 37.23,7.63 52.89,7.63 53.26,8 53.26,8.53 52.63,9.16 52.63,9.26 43.97,17.92 v43.97,18.1
USB_D_N  (via drill 0.3)
  Top 0.15: v27.57,5.08 27.79,5.08 27.79,5.33 27.31,5.81 27.31,6.03 27.21,6.13 U1.70
  Bottom 0.15: U$19.74 27.65,2.88 27.79,3.02 27.79,5.08 v27.57,5.08
USB_D_P  (via drill 0.3)
  Top 0.15: v28.32,5.08 28.09,5.08 28.09,5.46 27.61,5.94 27.61,6.03 27.71,6.13 U1.71
  Bottom 0.15: U$19.76 28.25,2.86 28.09,3.02 28.09,5.08 v28.32,5.08
USB_ID  (via drill 0.35)
  Top 0.305: U1.69 26.67,6.8 26.67,7.68 26.35,7.99 v26.35,8.1
  Bottom 0.305: v26.35,8.1 26.89,7.4 26.96,7.33 26.96,4.83 27.05,4.74 U$19.72
VSUP
  Top 0.305: U$19.199 64.77,1.52 U$19.197
  Top 0.813: 64.77,1.52 64.77,5.87 64.45,6.19 PTC1.2

### Text on the board
tSilk: MCU NODE / Version 2
_tplace: * | * | * | *